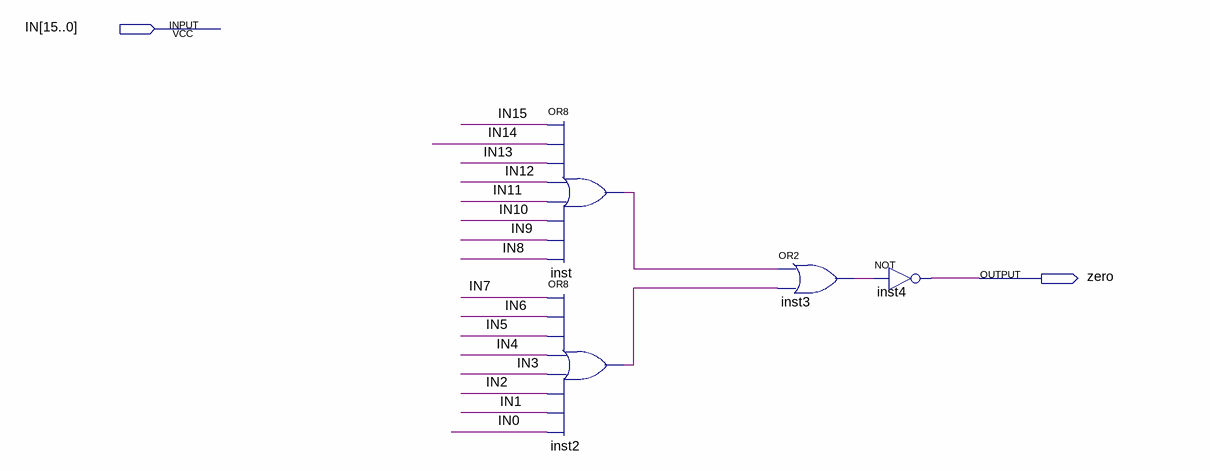
[diagram p0: schematic sheet]
// Quartus schematic ZERO.bdf as structural Verilog: 4 symbols, 2 pins
module ZERO (
  input  [15:0] IN,
  output zero
);

  wire inst2_out, inst3_out, inst_out;

  or inst (inst_out, IN[15], IN[14], IN[13], IN[12], IN[11], IN[10], IN[9], IN[8]);
  or inst2 (inst2_out, IN[7], IN[6], IN[5], IN[4], IN[3], IN[2], IN[1], IN[0]);
  or inst3 (inst3_out, inst_out, inst2_out);
  not inst4 (zero, inst3_out);
endmodule
